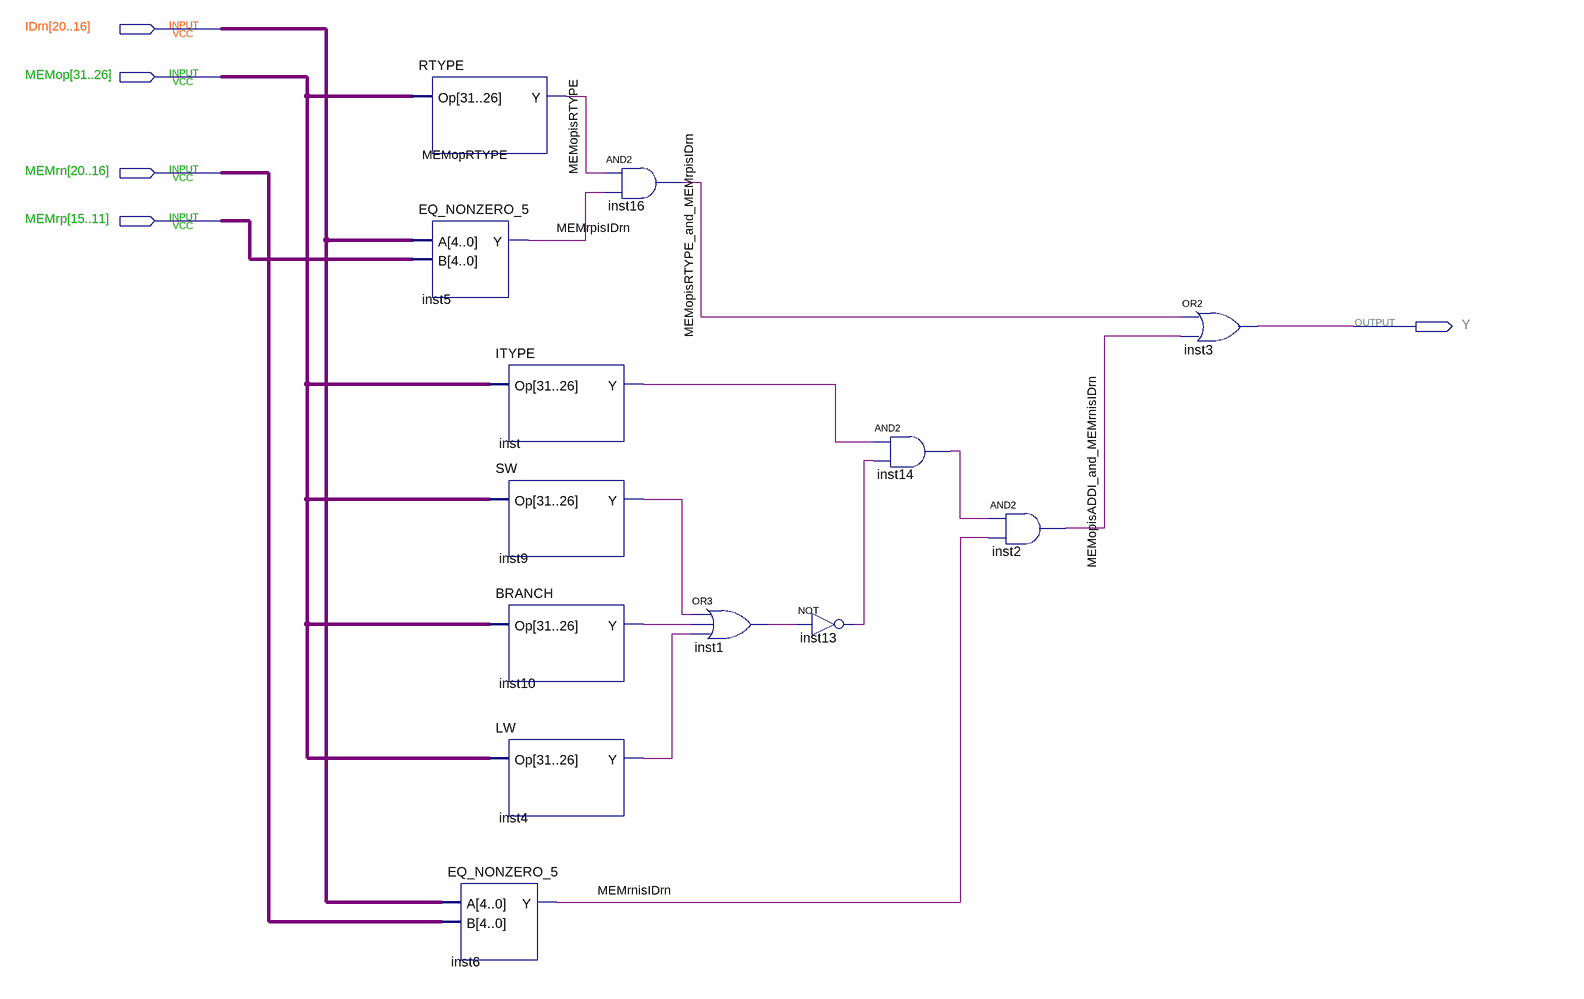
[diagram p0: schematic sheet]
// Quartus schematic ForwardBfromMEMtoID.bdf as structural Verilog: 13 symbols, 5 pins
module ForwardBfromMEMtoID (
  input  [20:16] IDrn,
  input  [31:26] MEMop,
  input  [20:16] MEMrn,
  input  [15:11] MEMrp,
  output Y
);

  wire inst1_out, inst4_y, inst9_y, inst10_y, inst13_out, inst14_out, inst_y, MEMopisADDI_and_MEMrnisIDrn,
       MEMopisRTYPE, MEMopisRTYPE_and_MEMrpisIDrn, MEMrnisIDrn, MEMrpisIDrn;

  RTYPE MEMopRTYPE (.Op(MEMop), .Y(MEMopisRTYPE));
  EQ_NONZERO_5 inst5 (.A(IDrn), .B(MEMrp), .Y(MEMrpisIDrn));
  EQ_NONZERO_5 inst6 (.A(IDrn), .B(MEMrn), .Y(MEMrnisIDrn));
  ITYPE inst (.Op(MEMop), .Y(inst_y));
  SW inst9 (.Op(MEMop), .Y(inst9_y));
  BRANCH inst10 (.Op(MEMop), .Y(inst10_y));
  LW inst4 (.Op(MEMop), .Y(inst4_y));
  and inst16 (MEMopisRTYPE_and_MEMrpisIDrn, MEMopisRTYPE, MEMrpisIDrn);
  or inst1 (inst1_out, inst9_y, inst10_y, inst4_y);
  not inst13 (inst13_out, inst1_out);
  and inst14 (inst14_out, inst_y, inst13_out);
  and inst2 (MEMopisADDI_and_MEMrnisIDrn, inst14_out, MEMrnisIDrn);
  or inst3 (Y, MEMopisRTYPE_and_MEMrpisIDrn, MEMopisADDI_and_MEMrnisIDrn);
endmodule
